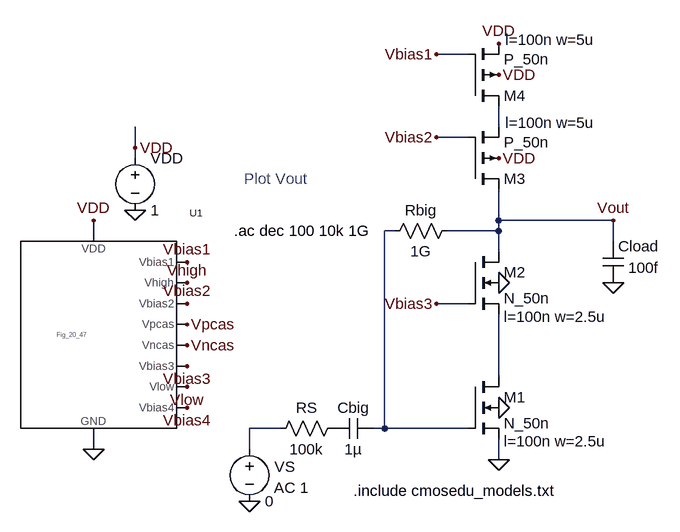
[diagram p0: schematic Fig21_36.asc]
Fig21_36.asc, the LTspice schematic file:
Version 4
SHEET 1 1696 680
WIRE 1376 -496 1328 -496
WIRE 1424 -384 1424 -416
WIRE 1376 -368 1328 -368
WIRE 864 -352 864 -384
WIRE 864 -336 864 -352
WIRE 1424 -240 1424 -288
WIRE 1600 -240 1424 -240
WIRE 1264 -224 1248 -224
WIRE 1424 -224 1424 -240
WIRE 1424 -224 1344 -224
WIRE 1600 -208 1600 -240
WIRE 1424 -192 1424 -224
WIRE 1376 -112 1328 -112
WIRE 1424 0 1424 -96
WIRE 1088 80 1040 80
WIRE 1248 80 1248 -224
WIRE 1248 80 1232 80
WIRE 1376 80 1248 80
WIRE 1040 112 1040 80
WIRE 1424 128 1424 96
FLAG 864 -256 0
FLAG 864 -352 VDD
FLAG 1424 48 0
FLAG 1424 128 0
FLAG 1600 -144 0
FLAG 1424 -144 0
FLAG 1424 -512 VDD
FLAG 1424 -464 VDD
FLAG 1424 -336 VDD
FLAG 1328 -496 Vbias1
FLAG 1328 -368 Vbias2
FLAG 1328 -112 Vbias3
FLAG 800 -240 VDD
FLAG 800 112 0
FLAG 944 -176 Vbias1
FLAG 944 -144 Vhigh
FLAG 944 -112 Vbias2
FLAG 944 -16 Vbias3
FLAG 944 -80 Vpcas
FLAG 944 -48 Vncas
FLAG 944 48 Vbias4
FLAG 944 16 Vlow
FLAG 1040 192 0
FLAG 1600 -240 Vout
SYMBOL voltage 864 -352 R0
WINDOW 123 0 0 Left 2
WINDOW 39 0 0 Left 2
SYMATTR InstName VDD
SYMATTR Value 1
SYMBOL nmos4 1376 0 R0
WINDOW 123 56 100 Left 2
SYMATTR Value2 l=100n w=2.5u
SYMATTR InstName M1
SYMATTR Value N_50n
SYMBOL nmos4 1376 -192 R0
WINDOW 123 56 100 Left 2
SYMATTR Value2 l=100n w=2.5u
SYMATTR InstName M2
SYMATTR Value N_50n
SYMBOL pmos4 1376 -416 M180
WINDOW 123 58 102 Left 2
WINDOW 0 56 16 Left 2
SYMATTR Value2 l=100n w=5u
SYMATTR InstName M4
SYMATTR Value P_50n
SYMBOL pmos4 1376 -288 M180
WINDOW 123 58 102 Left 2
WINDOW 0 56 16 Left 2
SYMATTR Value2 l=100n w=5u
SYMATTR InstName M3
SYMATTR Value P_50n
SYMBOL Fig_20_47 800 -64 R0
SYMATTR InstName U1
SYMBOL cap 1584 -208 R0
WINDOW 3 39 41 Left 2
SYMATTR Value 100f
SYMATTR InstName Cload
SYMBOL voltage 1040 96 R0
WINDOW 0 39 43 Left 2
WINDOW 123 38 75 Left 2
WINDOW 39 0 0 Left 2
SYMATTR InstName VS
SYMATTR Value2 AC 1
SYMATTR Value 0
SYMBOL res 1072 96 R270
WINDOW 0 32 56 VTop 2
WINDOW 3 0 56 VBottom 2
SYMATTR InstName RS
SYMATTR Value 100k
SYMBOL res 1248 -208 R270
WINDOW 0 32 56 VTop 2
WINDOW 3 0 56 VBottom 2
SYMATTR InstName Rbig
SYMATTR Value 1G
SYMBOL cap 1168 96 R270
WINDOW 0 32 32 VTop 2
WINDOW 3 0 32 VBottom 2
SYMATTR InstName Cbig
SYMATTR Value 1µ
TEXT 1200 176 Left 2 !.include cmosedu_models.txt
TEXT 1032 -304 Left 2 ;Plot Vout
TEXT 1016 -224 Left 2 !.ac dec 100 10k 1G

The netlist it stands for:
* Fig21_36.asc
VDD VDD 0 1
M1 N003 N002 0 0 N_50n l=100n w=2.5u
M2 Vout Vbias3 N003 0 N_50n l=100n w=2.5u
M4 N001 Vbias1 VDD VDD P_50n l=100n w=5u
M3 Vout Vbias2 N001 VDD P_50n l=100n w=5u
XU1 Vbias1 Vhigh Vbias2 Vpcas Vncas Vbias3 Vlow Vbias4 VDD 0 Fig_20_47  ; pins Vbias1 Vhigh Vbias2 Vpcas Vncas Vbias3 Vlow Vbias4 VDD GND
Cload Vout 0 100f
VS N004 0 0 AC 1
RS N004 P001 100k
Rbig N002 Vout 1G
Cbig P001 N002 1µ
.model NMOS NMOS
.model PMOS PMOS
.lib standard.mos
.include cmosedu_models.txt
* Plot Vout
.ac dec 100 10k 1G
.backanno
.end